# EAGLE design basic-HR20 (EAGLE 6.6.0)
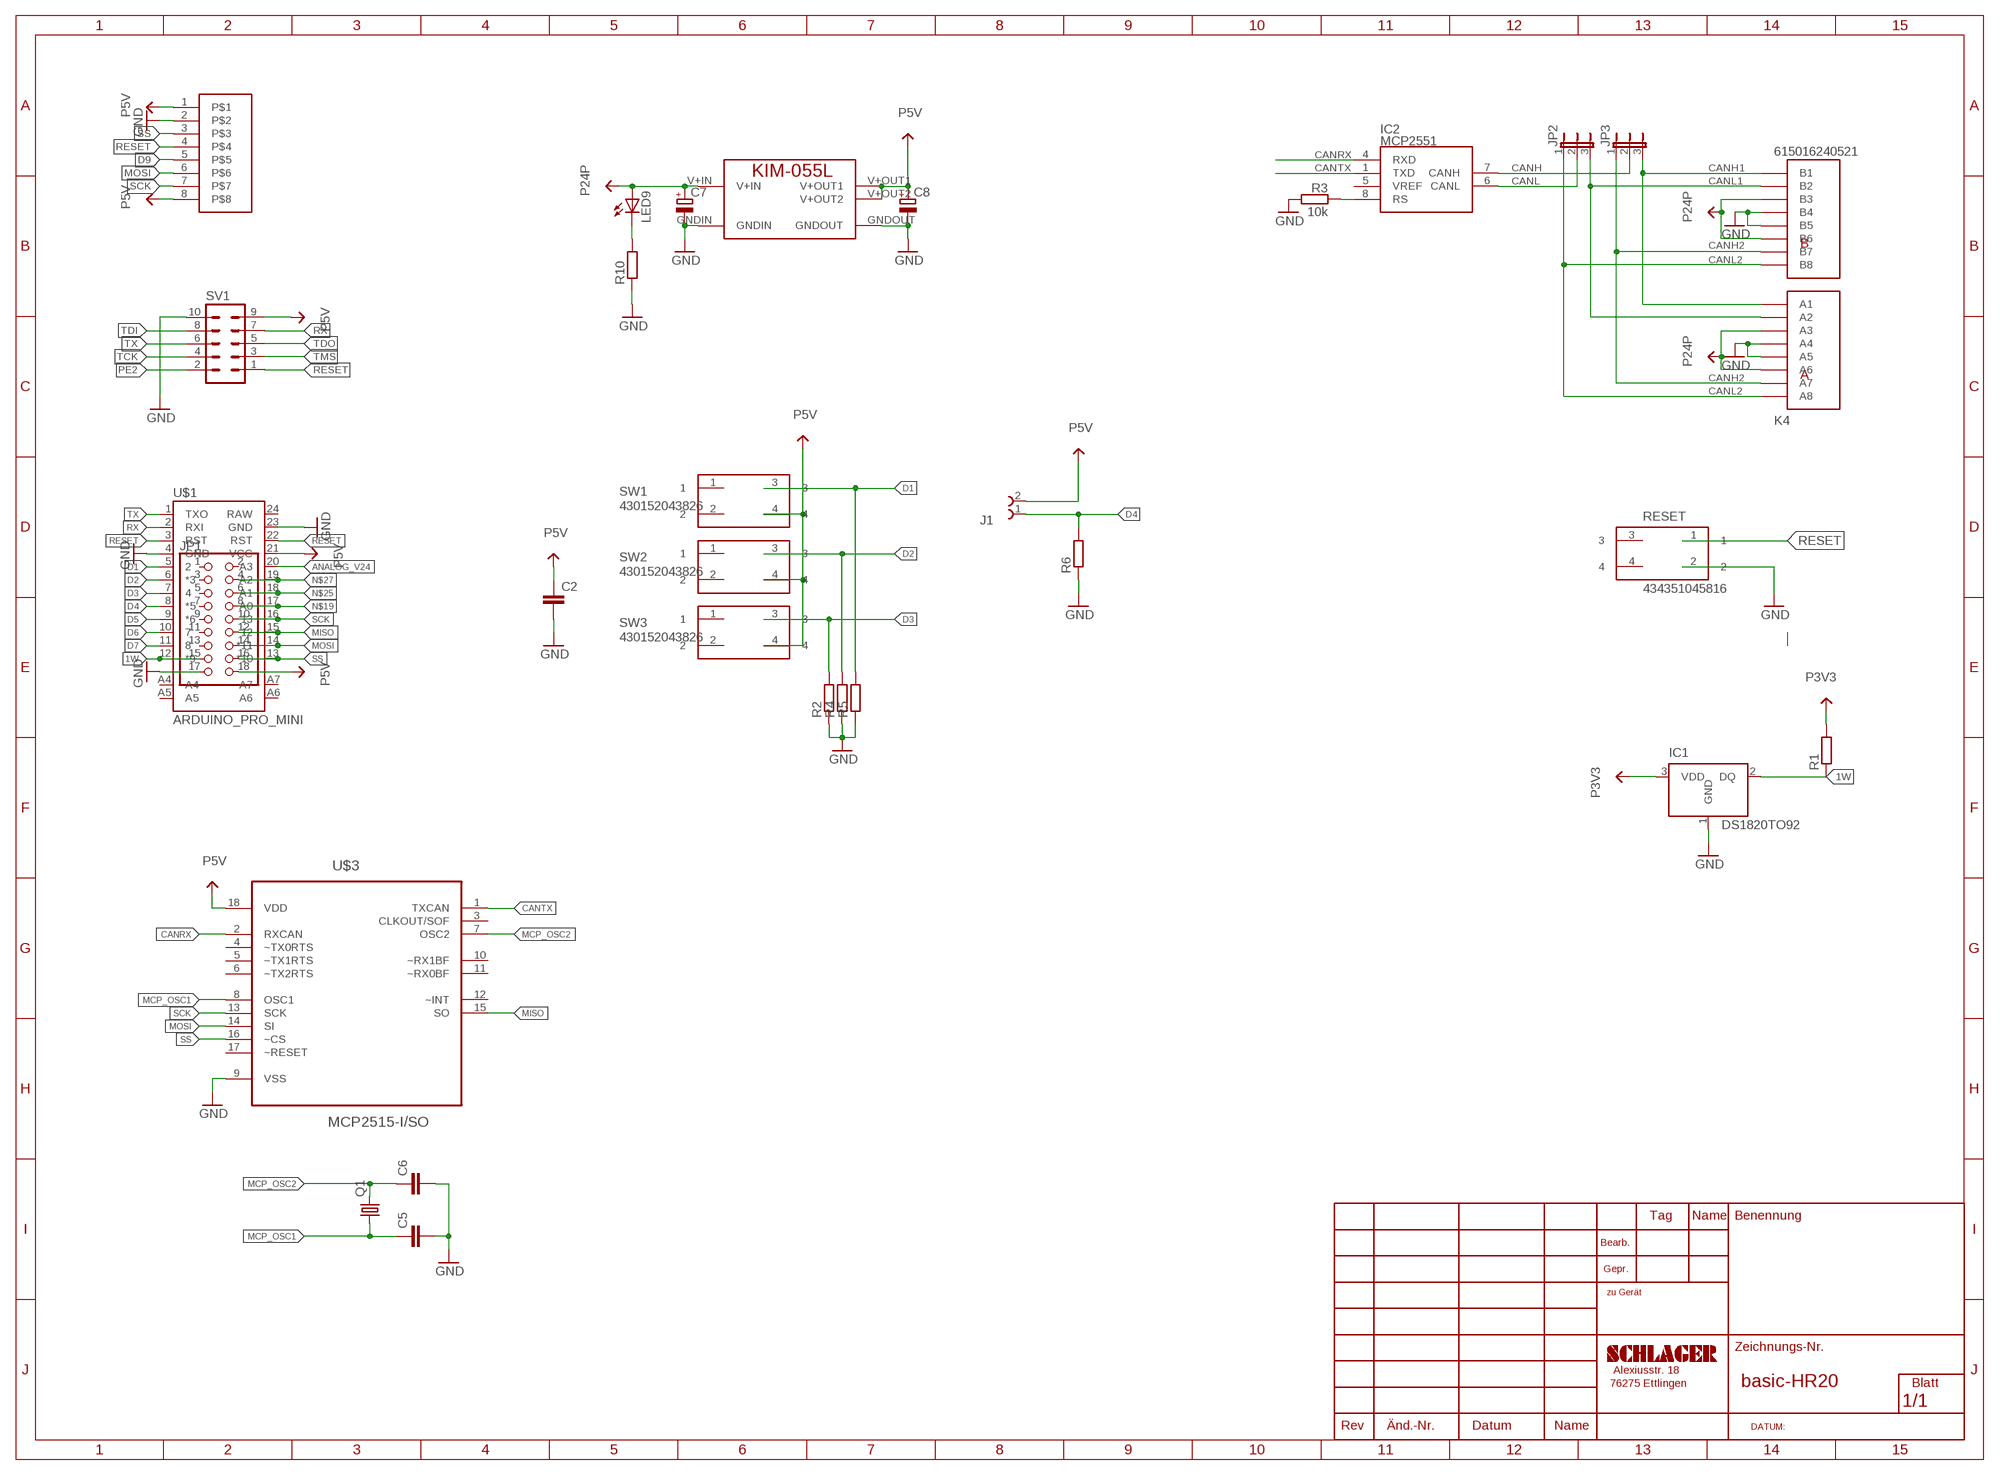
[diagram p0: schematic, sheet 1]

## Parts
C2  C-EUC0805  [C0805]
C5  C-EUC0805  [C0805]
C6  C-EUC0805  [C0805]
C7  CPOL-EUE5-10.5  [E5-10,5]
C8  CPOL-EUE5-10.5  [E5-10,5]
IC1  DS1820TO92  [TO-92]
IC2  MCP2551  [SO-8]
J1  691312510002  [691312510002]
JP1  PINHD-2X9  [2X09]
JP2  JP2E  [JP2]
JP3  JP2E  [JP2]
K4  615016240521  [615016240521]
LED9  LED3MM  [LED3MM]
MOD1  KIM-055L  [KIM-055L]
Q1  CRYSTALHC49S  [HC49/S]
R1  R-EU_M0805  [M0805]
R2  R-EU_R0805  [R0805]
R3  10k  R-EU_R0603  [R0603]
R4  R-EU_R0805  [R0805]
R5  R-EU_R0805  [R0805]
R6  R-EU_R0805  [R0805]
R10  R-EU_R0805  [R0805]
RESET  434351045816  [434351045816]
SV1  ML10  [ML10]
SW1  430152043826  [430152043826]
SW2  430152043826  [430152043826]
SW3  430152043826  [430152043826]
U$1  ARDUINO_PRO_MINI  [ARDUINO_PRO_MINI]
U$2  1.44-128X128  [1.44-128X128]
U$3  MCP2515-I/SO  [SOIC127P1034X264-18N]

## Nets
1W: IC1.2(DQ) JP1.15 R1.1 U$1.12(*9)
ANALOG_V24: U$1.20(A3)
CANH: IC2.7(CANH) JP3.2
CANH1: JP3.3 K4.A1 K4.B1
CANH2: JP3.1 K4.A7 K4.B7
CANL: IC2.6(CANL) JP2.2
CANL1: JP2.3 K4.A2 K4.B2
CANL2: JP2.1 K4.A8 K4.B8
CANRX: IC2.4(RXD) U$3.2(RXCAN)
CANTX: IC2.1(TXD) U$3.1(TXCAN)
D1: R5.2 SW1.3 U$1.5
D2: R4.2 SW2.3 U$1.6(*3)
D3: R2.2 SW3.3 U$1.7
D4: J1.1 R6.2 U$1.8(*5)
D5: U$1.9(*6)
D6: U$1.10
D7: U$1.11
D9: U$2.5
GND: C2.2 C5.2 C6.2 C7.- C8.- IC1.1(GND) JP1.17 K4.A4 K4.A5 K4.B4 K4.B5 MOD1.GNDIN MOD1.GNDOUT R2.1 R3.2 R4.1 R5.1 R6.1 R10.1 RESET.2 SV1.10 U$1.4(GND) U$1.23(GND) U$2.2 U$3.9(VSS)
MCP_OSC1: C5.1 Q1.1 U$3.8(OSC1)
MCP_OSC2: C6.1 Q1.2 U$3.7(OSC2)
MISO: JP1.12 U$1.15 U$3.15(SO)
MOSI: JP1.14 U$1.14(*11) U$2.6 U$3.14(SI)
N$2: IC2.8(RS) R3.1
N$9: LED9.K(C) R10.2
N$19: JP1.8 U$1.17(A0)
N$25: JP1.6 U$1.18(A1)
N$27: JP1.4 U$1.19(A2)
P3V3: IC1.3(VDD) R1.2
P5V: C2.1 C8.+ J1.2 JP1.18 MOD1.V+OUT1 MOD1.V+OUT2 SV1.9 SW1.4 SW2.4 SW3.4 U$1.21(VCC) U$2.1 U$2.8 U$3.18(VDD)
P24P: C7.+ K4.A3 K4.A6 K4.B3 K4.B6 LED9.A MOD1.V+IN
PE2: SV1.2
RESET: RESET.1 SV1.1 U$1.3(RST) U$1.22(RST) U$2.4
RX: SV1.7 U$1.2(RXI)
SCK: JP1.10 U$1.16 U$2.7 U$3.13(SCK)
SS: JP1.16 U$1.13(*10) U$2.3 U$3.16(~CS)
TCK: SV1.4
TDI: SV1.8
TDO: SV1.5
TMS: SV1.3
TX: SV1.6 U$1.1(TXO)
Unconnected: IC2.2(GND) IC2.3(VCC) IC2.5(VREF) JP1.1 JP1.2 JP1.3 JP1.5 JP1.7 JP1.9 JP1.11 JP1.13 RESET.3 RESET.4 SW1.1 SW1.2 SW2.1 SW2.2 SW3.1 SW3.2 U$1.24(RAW) U$1.A4 U$1.A5 U$1.A6 U$1.A7 U$3.3(CLKOUT/SOF) U$3.4(~TX0RTS) U$3.5(~TX1RTS) U$3.6(~TX2RTS) U$3.10(~RX1BF) U$3.11(~RX0BF) U$3.12(~INT) U$3.17(~RESET)

## Library data of the parts
C2 C5 C6 = schlager_passiv:C-EU: CAPACITOR, European symbol
C7 C8 = schlager_passiv:CPOL-EU: POLARIZED CAPACITOR, European symbol
IC1 = schlager_ics:DS1820: DS1820 - 1-Wire Digital Thermometer
IC2 = MYMCHIP:MCP2551: CAN Transceiver
J1 = Eagle_TERMINAL_BLOCKS_rev16a:691312510002: WR-TBL Serie 312 - 5.08 mm Open Horizontal PCB Header , 2 Pins=>Code : Con_TBL_Pluggable_5.08_PCB_THT_Simple_H_691312510002 <http://katalog.we-online.de/media/images/eican/Con_TBL_Pluggable_5.08_PCB_THT_Simple_H_6913125100xx_pf2.jpg> Details see: http://katalog.we-online.de/en/em/691_312_510_0xx Created 2014-06-25, Karrer Zheng 2014 (C) Würth Elektronik
JP1 = pinhead:PINHD-2X9: PIN HEADER
JP2 JP3 = jumper:JP2E: JUMPER
K4 = Wuerth_Elektronik_eiCan_Communication_Connectors:615016240521: WR-MJ Horizontal Shielded Dual Stacked Port with EMI Panel Finger 8P8C Modular Jack Tab Up & Down, 16 Pins
LED9 = led:LED: LED OSRAM: - CHIPLED LG R971, LG N971, LY N971, LG Q971, LY Q971, LO R971, LY R971 LH N974, LH R974 LS Q976, LO Q976, LY Q976 LO Q996 - Hyper CHIPLED LW Q18S LB Q993, LB Q99A, LB R99A - SideLED LS A670, LO A670, LY A670, LG A670, LP A670 LB A673, LV A673, LT A673, LW A673 LH A674 LY A675 LS A676, LA A676, LO A676, LY A676, LW A676 LS A679, LY A679, LG A679 - Hyper Micro SIDELED® LS Y876, LA Y876, LO Y876, LY Y876 LT Y87S - SmartLED LW L88C, LW L88S LB L89C, LB L89S, LG L890 LS L89K, LO L89K, LY L89K LS L896, LA L896, LO L896, LY L896 - TOPLED LS T670, LO T670, LY T670, LG T670, LP T670 LSG T670, LSP T670, LSY T670, LOP T670, LYG T670 LG T671, LOG T671, LSG T671 LB T673, LV T673, LT T673, LW T673 LH T674 LS T676, LA T676, LO T676, LY T676, LB T676, LH T676, LSB T676, LW T676 LB T67C, LV T67C, LT T67C, LS T67K, LO T67K, LY T67K, LW E67C LS E67B, LA E67B, LO E67B, LY E67B, LB E67C, LV E67C, LT E67C LW T67C LS T679, LY T679, LG T679 LS T770, LO T770, LY T770, LG T770, LP T770 LB T773, LV T773, LT T773, LW T773 LH T774 LS E675, LA E675, LY E675, LS T675 LS T776, LA T776, LO T776, LY T776, LB T776 LHGB T686 LT T68C, LB T68C - Hyper Mini TOPLED® LB M676 - Mini TOPLED Santana® LG M470 LS M47K, LO M47K, LY M47K Source: http://www.osram.convergy.de LUXEON: - LUMILED® LXK2-PW12-R00, LXK2-PW12-S00, LXK2-PW14-U00, LXK2-PW14-V00 LXK2-PM12-R00, LXK2-PM12-S00, LXK2-PM14-U00 LXK2-PE12-Q00, LXK2-PE12-R00, LXK2-PE12-S00, LXK2-PE14-T00, LXK2-PE14-U00 LXK2-PB12-K00, LXK2-PB12-L00, LXK2-PB12-M00, LXK2-PB14-N00, LXK2-PB14-P00, LXK2-PB14-Q00 LXK2-PR12-L00, LXK2-PR12-M00, LXK2-PR14-Q00, LXK2-PR14-R00 LXK2-PD12-Q00, LXK2-PD12-R00, LXK2-PD12-S00 LXK2-PH12-R00, LXK2-PH12-S00 LXK2-PL12-P00, LXK2-PL12-Q00, LXK2-PL12-R00 Source: www.luxeon.com KINGBRIGHT: KA-3528ASYC Source: www.kingbright.com
MOD1 = kim055l:KIM-055L: 5V 5amp DC DC module. IMPORANT: Add low ESR input & output capacitors. V+OUT1 & V+OUT2 internally connected.
Q1 = crystal:CRYSTAL: CRYSTAL; OC_FARNELL: 1667008; OC_NEWARK: unknown
R1 R2 R4-R6 R10 = schlager_passiv:R-EU_: RESISTOR, European symbol
R3 = rcl:R-EU_: RESISTOR, European symbol
RESET = Illuminated_Switches:434351045816: WS-TUS-3.5x4.7 mm side push SMD Tact Switch, 4 pins
SV1 = X_Pfostenstecker:ML10: HARTING; OC_FARNELL: unknown; OC_NEWARK: unknown
SW1-SW3 = Wuerth_Elektronik_Switch:430152043826: WS-TSS-6x6 mm SMD Tact Switch,4 pins
U$1 = SparkFun-Boards:ARDUINO_PRO_MINI
U$2 = schlager_modules:1.44-128X128
U$3 = schlager_ics:MCP2515-I/SO: CAN Controller; MPN: MCP2515-I/SO; OC_FARNELL: 1292239; OC_NEWARK: 29H7136; PACKAGE: SOIC-18; SUPPLIER: Microchip

## Net classes
4 USBpair: width 0.254 mm, drill 0.406 mm, clearance 0.508 mm

## Board
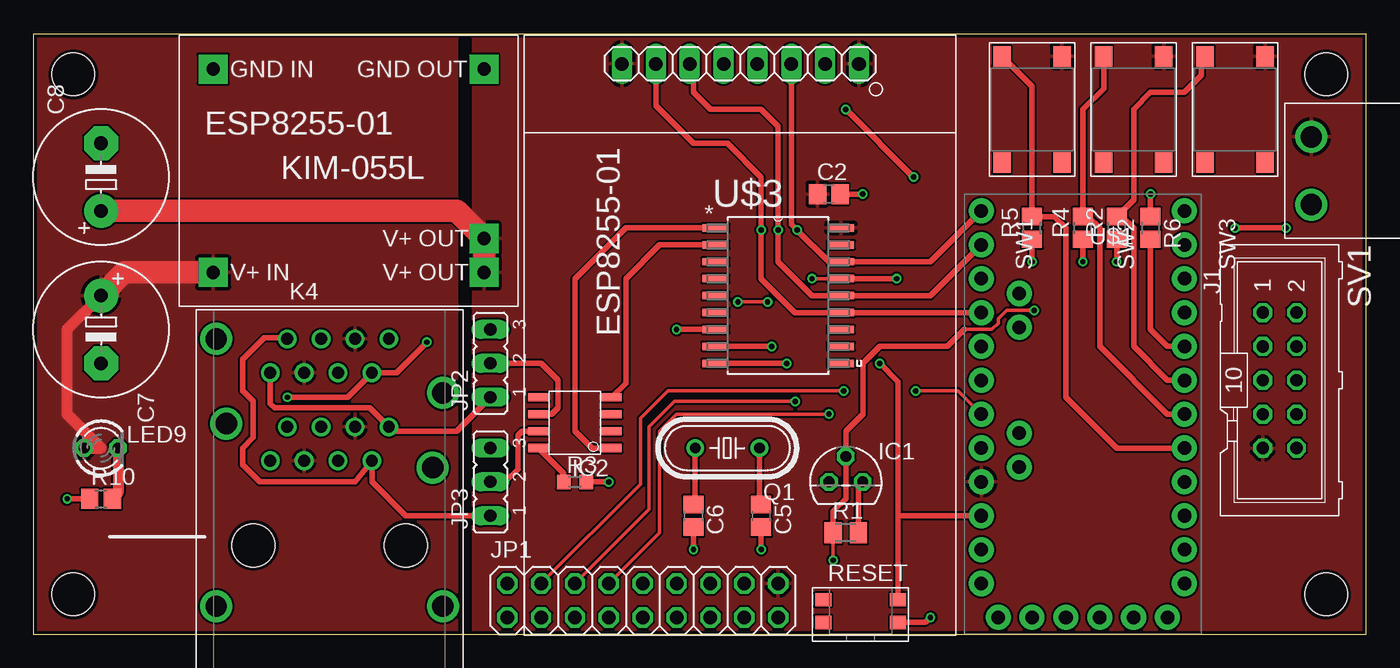
[diagram p1: board, top side]
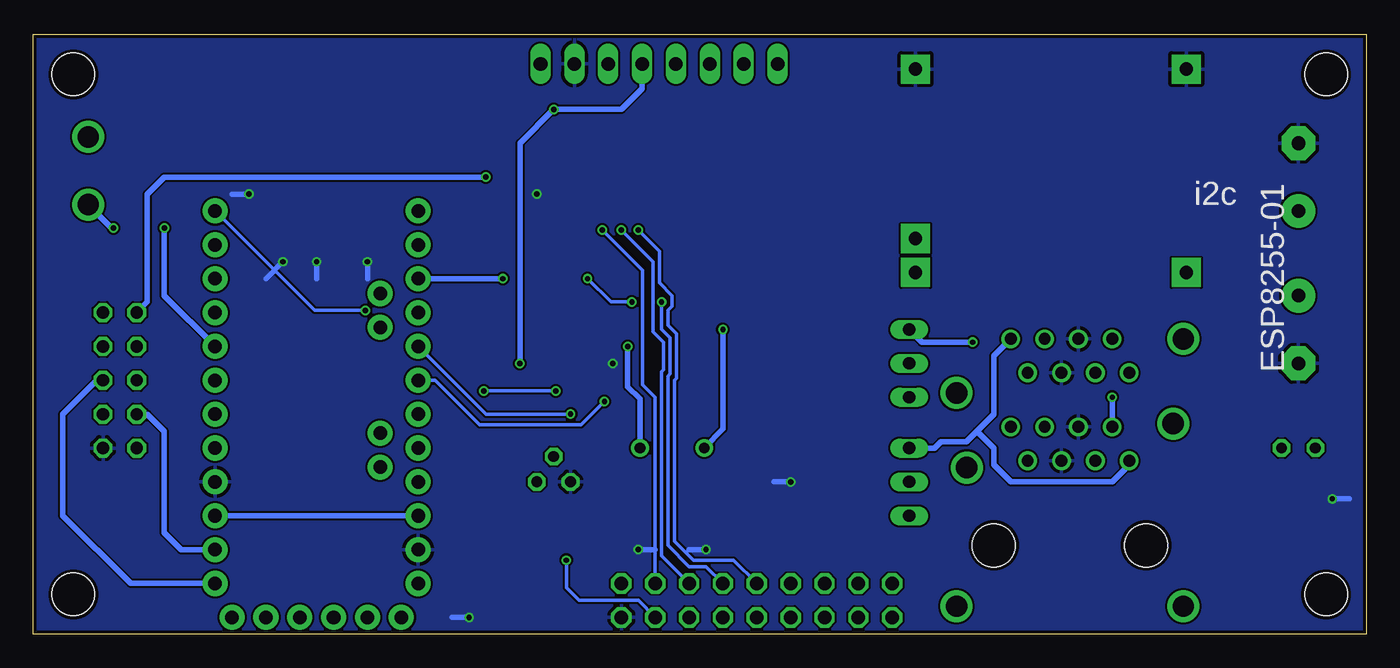
[diagram p2: board, bottom side, seen from below]

Size 100 x 45 mm. Coordinates in mm from the lower left corner, seen from the top.
Outline: 0,0 100,0 100,45 0,45 0,0
Copper layers (1*16): Top 0.035mm / dielectric 1.5mm / Bottom 0.035mm
Design rules "ITEADstudio_DRC": minimum track width 6mil, minimum drill 12mil, track to track 6mil, track to pad 6mil, pad to pad 6mil, via to via 6mil, smd to smd 0mil, copper to edge 10mil, drill to drill 10mil, minimum pad ring 10mil, minimum via ring 6mil, stop-mask expansion 2mil, vias tented up to drill 100mil, thermal gap 10mil
Holes 3.2 mm at 3,3 3,42 97,42 97,3

### Footprints (pad centres in the part's own frame; a part is rotated, then mirrored left to right if it is on the bottom)
C0805 = smd 1.3 x 1.5: 1 -0.85,0; 2 0.85,0
E5-10,5 = drill 1.016 pad 2.54: + -2.54,0 | drill 1.016 pad 2.54 octagon: - 2.54,0
TO-92 = drill 0.813 pad 1.27 octagon: 1 -1.27,0; 2 0,1.905; 3 1.27,0
SO-8 = smd 0.61 x 1.524: 1 0,-0.203; 2 1.27,-0.203; 3 2.54,-0.203; 4 3.81,-0.203; 5 3.81,5.283; 6 2.54,5.283; 7 1.27,5.283; 8 0,5.283
691312510002 = drill 1.6: 1 -5.08,0; 2 0,0
2X09 = drill 1.016 octagon: 1 -10.16,-1.27; 2 -10.16,1.27; 3 -7.62,-1.27; 4 -7.62,1.27; 5 -5.08,-1.27; 6 -5.08,1.27; 7 -2.54,-1.27; 8 -2.54,1.27; 9 0,-1.27; 10 0,1.27; 11 2.54,-1.27; 12 2.54,1.27; 13 5.08,-1.27; 14 5.08,1.27; 15 7.62,-1.27; 16 7.62,1.27; 17 10.16,-1.27; 18 10.16,1.27
JP2 = drill 0.914 long: 1 -2.54,0; 2 0,0; 3 2.54,0
615016240521 = drill 0.89: A1 -4.445,-1.27; A2 -3.175,1.27; A3 -1.905,-1.27; A4 -0.635,1.27; A5 0.635,-1.27; A6 1.905,1.27; A7 3.175,-1.27; A8 4.445,1.27; B1 4.445,7.87; B2 3.175,5.33; B3 1.905,7.87; B4 0.635,5.33; B5 -0.635,7.87; B6 -1.905,5.33; B7 -3.175,7.87; B8 -4.445,5.33 | drill 1.6: Z1 -8.505,-12.19; Z2 8.505,-12.19; Z3 7.745,-1.78; Z4 -7.745,1.52; Z5 8.505,3.81; Z6 -8.505,7.87 | hole 3.25: -5.715,-7.62; 5.715,-7.62
LED3MM = drill 0.813 octagon: A -1.27,0; K 1.27,0
KIM-055L = drill 1 pad 2.184 square: GNDIN -10.16,7.62; GNDOUT 10.16,7.62; V+IN -10.16,-7.62; V+OUT1 10.16,-5.08; V+OUT2 10.16,-7.62
HC49/S = drill 0.813: 1 -2.413,0; 2 2.413,0
M0805 = smd 1.3 x 1.6: 1 -0.95,0; 2 0.95,0
R0805 = smd 1.3 x 1.5: 1 -0.85,0; 2 0.85,0
R0603 = smd 1 x 1.1: 1 -0.85,0; 2 0.85,0
434351045816 = smd 1.2 x 1: 1 2.8,0.85; 2 2.8,-0.85; 3 -2.8,0.85; 4 -2.8,-0.85
ML10 = drill 0.914 octagon: 1 -5.08,-1.27; 2 -5.08,1.27; 3 -2.54,-1.27; 4 -2.54,1.27; 5 0,-1.27; 6 0,1.27; 7 2.54,-1.27; 8 2.54,1.27; 9 5.08,-1.27; 10 5.08,1.27
430152043826 = smd 1.55 x 1.3: 1 -3.975,2.25; 2 -3.975,-2.25; 3 3.975,2.25; 4 3.975,-2.25
ARDUINO_PRO_MINI = drill 1.016 pad 1.88: 1 -7.62,12.7; 2 -7.62,10.16; 3 -7.62,7.62; 4 -7.62,5.08; 5 -7.62,2.54; 6 -7.62,0; 7 -7.62,-2.54; 8 -7.62,-5.08; 9 -7.62,-7.62; 10 -7.62,-10.16; 11 -7.62,-12.7; 12 -7.62,-15.24; 13 7.62,-15.24; 14 7.62,-12.7; 15 7.62,-10.16; 16 7.62,-7.62; 17 7.62,-5.08; 18 7.62,-2.54; 19 7.62,0; 20 7.62,2.54; 21 7.62,5.08; 22 7.62,7.62; 23 7.62,10.16; 24 7.62,12.7; A4 4.763,1.429; A5 4.763,3.969; A6 4.763,-9.049; A7 4.763,-6.509; BLK -6.35,15.24; GND -3.81,15.24; GRN 6.35,15.24; RXI 1.27,15.24; TXO 3.81,15.24; VCC -1.27,15.24
1.44-128X128 = drill 1.016 long: 1 7.27,2.14; 2 9.81,2.14; 3 12.35,2.14; 4 14.89,2.14; 5 17.43,2.14; 6 19.97,2.14; 7 22.51,2.14; 8 25.05,2.14
SOIC127P1034X264-18N = smd 1.981 x 0.559: 1 -4.699,5.08; 2 -4.699,3.81; 3 -4.699,2.54; 4 -4.699,1.27; 5 -4.699,0; 6 -4.699,-1.27; 7 -4.699,-2.54; 8 -4.699,-3.81; 9 -4.699,-5.08; 10 4.699,-5.08; 11 4.699,-3.81; 12 4.699,-2.54; 13 4.699,-1.27; 14 4.699,0; 15 4.699,1.27; 16 4.699,2.54; 17 4.699,3.81; 18 4.699,5.08

### Placement (x,y rotation side)
C2  59.69,33.02 0 top
C5  54.61,8.89 270 top
C6  49.53,8.89 270 top
C7  5.08,22.86 270 top
C8  5.08,34.29 90 top
IC1  60.96,11.43 0 top
IC2  43.18,13.97 90 top
J1  95.89,37.31 90 top
JP1  45.72,2.54 0 top
JP2  34.29,20.32 90 top
JP3  34.29,11.43 90 top
K4  22.23,14.29 0 top
LED9  5.08,13.97 0 top
MOD1  23.65,34.77 0 top
Q1  52.07,13.97 180 top
R1  60.96,7.62 0 top
R2  81.28,30.48 90 top
R3  40.64,11.43 0 top
R4  78.74,30.48 90 top
R5  74.93,30.48 90 top
R6  83.82,30.48 270 top
R10  5.08,10.16 0 top
RESET  62.07,1.75 0 top
SV1  93.5,19.05 270 top
SW1  74.93,39.37 90 top
SW2  82.55,39.37 90 top
SW3  90.17,39.37 90 top
U$1  78.74,16.51 180 top
U$2  69.22,44.93 180 top
U$3  55.88,25.4 0 top

### Tracks (layer width: path | path; a pad name or v marks a point on that pad's centre or on a via)
1W  (via drill 0.4)
  Top 0.254: 69.85,22.86 71.91,22.86 72.39,23.34 72.39,23.65 73.03,24.29 v75.09,24.29 | v60.01,5.56 R1.1
  Top 0.406: R1.1 60.01,9.21 60.96,10.16 IC1.2 60.96,15.24 62.23,16.51 62.23,20.32 63.5,21.59 68.58,21.59 69.85,22.86
  Bottom 0.254: v75.09,24.29 78.9,24.29 U$1.12 | JP1.15 54.61,2.54 59.05,2.54 60.01,3.49 v60.01,5.56
CANH
  Top 0.406: IC2.7 36.67,15.24 36.35,14.92 36.35,12.38 35.4,11.43 JP3.2
CANH1
  Bottom 0.406: JP3.3 32.38,13.97 31.91,14.45 30,14.45 29.21,15.24 | 29.21,15.24 27.94,16.51 27.94,20.89 K4.B1 | K4.A1 17.78,12.7 19.05,11.43 26.67,11.43 27.94,12.7 27.94,13.97 29.21,15.24
CANH2
  Top 0.406: JP3.1 27.94,8.89 25.4,11.43 K4.A7 24.13,11.43 16.99,11.43 15.72,12.7 15.72,13.97 16.51,14.76 16.51,17.46 15.72,18.26 15.72,20.64 17.3,22.23 18.98,22.23 K4.B7
CANL
  Top 0.406: JP2.2 38.1,20.32 39.37,19.05 39.37,16.99 38.89,16.51 IC2.6
CANL1  (via drill 0.4)
  Top 0.406: v19.05,17.78 23.56,17.78 K4.B2 27.24,19.62 v29.53,21.91
  Bottom 0.406: K4.A2 v19.05,17.78 | v29.53,21.91 33.34,21.91 JP2.3
CANL2
  Top 0.406: JP2.1 31.75,15.24 26.99,15.24 K4.A8 25.24,16.99 18.1,16.99 17.78,17.3 K4.B8
CANRX
  Top 0.406: U$3.2 46.99,29.21 44.45,26.67 44.45,18.85 IC2.4
CANTX
  Top 0.406: U$3.1 44.45,30.48 40.64,26.67 40.64,15.24 41.91,13.97 IC2.1
D1
  Top 0.406: SW1.3 74.93,41.09 R5.2 76.62,31.33 77.47,30.48 77.47,17.78 81.28,13.97 U$1.5
D2
  Top 0.406: SW2.3 80.3,40.93 78.74,39.37 R4.2 79.16,31.33 80.01,30.48 80.01,21.59 85.09,16.51 U$1.6
D3
  Top 0.406: SW3.3 87.63,43.05 87.63,41.91 86.36,40.64 83.82,40.64 82.55,39.37 82.55,32.6 R2.2 81.7,31.33 82.55,30.48 82.55,21.59 85.09,19.05 U$1.7
D4  (via drill 0.4)
  Top 0.406: U$1.8 85.09,21.59 83.82,22.86 R6.2 | v93.98,30.48 v90.17,30.48
  Bottom 0.406: v90.17,30.48 90.17,25.4 U$1.8 | v93.98,30.48 94.14,30.48 J1.1
GND  (via drill 0.4)
  Top 0.406: U$3.9 v56.52,20.32 | C6.2 v49.53,6.35 | C5.2 v54.61,6.35 | R3.2 v43.18,11.43 | R10.1 v2.54,10.16 | C2.2 v62.23,33.02 62.39,33.02 | RESET.2 66.94,0.9 v67.31,1.27 | R5.1 v74.93,27.94 | R4.1 v78.74,27.94 | R2.1 v81.28,27.94 | R6.1 v83.82,33.02
  Bottom 0.406: v49.53,6.35 50.8,6.35 | v54.61,6.35 53.34,6.35 | v43.18,11.43 44.45,11.43 | v2.54,10.16 1.27,10.16 | v67.31,1.27 68.58,1.27 | v74.93,27.94 74.93,26.67 | v78.74,27.94 78.74,26.67 | v81.28,27.94 82.55,26.67 | v83.82,33.02 85.09,33.02
  pour Bottom: -8.89,72.39 120.65,72.39 120.65,-13.97 -8.89,-13.97
MCP_OSC1  (via drill 0.4)
  Top 0.406: v55.4,21.59 U$3.8 | Q1.1 54.48,9.87 C5.1
  Bottom 0.406: Q1.1 54.48,17.65 55.4,18.57 v55.4,21.59
MCP_OSC2  (via drill 0.4)
  Top 0.406: Q1.2 49.66,9.87 C6.1 | v48.26,22.86 U$3.7
  Bottom 0.406: Q1.2 49.66,14 48.26,15.4 v48.26,22.86
MISO  (via drill 0.4)
  Top 0.254: v52.86,24.92 v55.09,24.92 | v58.42,26.67 U$3.15
  Top 0.406: U$3.15 v64.77,26.67
  Bottom 0.254: JP1.12 49.53,5.08 50.8,5.08 52.39,6.67 52.39,19.37 52.23,19.53 52.23,22.23 52.86,22.86 v52.86,24.92 | v55.09,24.92 56.67,24.92 v58.42,26.67
  Bottom 0.406: v64.77,26.67 U$1.15
MOSI  (via drill 0.4)
  Top 0.406: U$1.14 67.31,25.4 U$3.14 58.42,25.4 55.88,27.94 55.88,29.21 v55.88,30.32 55.88,38.1 54.61,39.37 50.8,39.37 49.53,40.64 49.53,42.5 U$2.6
  Bottom 0.254: JP1.14 52.86,5.87 52.86,19.68 52.7,19.84 52.7,21.91 53.5,22.7 53.5,27.94 v55.88,30.32
N$2
  Top 0.406: R3.1 39.79,12.08 IC2.8
N$9
  Top 0.813: LED9.K 6.35,10.58 R10.2
N$19  (via drill 0.4)
  Top 0.254: JP1.8 46.99,7.62 46.99,15.24 48.26,16.51 v59.69,16.51
  Bottom 0.254: v59.69,16.51 66.04,16.51 U$1.17
N$25  (via drill 0.4)
  Top 0.254: v57.15,17.46 48.1,17.46 46.2,15.56 46.2,9.37 JP1.6
  Bottom 0.254: U$1.18 69.85,19.05 66.52,15.72 58.9,15.72 v57.15,17.46
N$27  (via drill 0.4)
  Top 0.254: JP1.4 45.56,11.27 45.56,16.19 47.62,18.26 v60.8,18.26 | v66.2,18.26 69.37,18.26 U$1.19
  Bottom 0.254: v60.8,18.26 v66.2,18.26
P3V3
  Top 0.406: R1.2 61.91,11.11 IC1.3
P5V
  Top 1.676: C8.+ 31.75,31.75 MOD1.V+OUT1 MOD1.V+OUT2
  pour Top: 33.02,68.58 109.22,68.58 109.22,-13.97 33.02,-13.97
P24P
  Top 0.813: LED9.A 5.08,13.97 2.54,16.51 2.54,22.86 C7.+
  Top 1.676: MOD1.V+IN 6.83,27.15 C7.+
  pour Top: -16.51,68.58 31.75,68.58 31.75,-15.24 -16.51,-15.24
RESET  (via drill 0.4)
  Top 0.406: v60.96,39.37 v66.04,34.29 | RESET.1 64.87,8.89 | 64.87,8.89 64.87,18.95 v63.5,20.32 | U$1.22 64.87,8.89
  Bottom 0.406: U$2.4 54.33,40.92 55.88,39.37 v60.96,39.37 63.5,36.83 v63.5,20.32 | v66.04,34.29 90.17,34.29 91.44,33.02 91.44,24.92 SV1.1 | U$1.22 U$1.3
RX
  Bottom 0.406: SV1.7 91.44,16.51 90.17,15.24 90.17,7.62 88.9,6.35 U$1.2
SCK  (via drill 0.4)
  Top 0.406: U$1.16 U$3.13 57.15,24.13 54.61,26.67 54.61,29.37 v54.61,30.32 54.61,34.29 52.07,36.83 49.53,36.83 46.7,39.66 U$2.7
  Bottom 0.254: JP1.10 47.47,5.56 50.48,5.56 51.91,6.99 51.91,19.05 51.75,19.21 51.75,22.54 52.39,23.18 52.39,24.29 52.07,24.61 52.07,25.4 53.02,26.35 53.02,28.73 v54.61,30.32
SS  (via drill 0.4)
  Top 0.406: U$1.13 67.31,27.94 U$3.16 59.69,27.94 v57.31,30.32 56.87,30.77 U$2.3
  Bottom 0.254: JP1.16 53.34,17.78 54.29,18.73 54.29,27.3 v57.31,30.32
TX
  Bottom 0.406: SV1.6 95.25,19.05 97.79,16.51 97.79,8.89 92.71,3.81 U$1.1

### Text on the board
tNames: ESP8255-01 | ESP8255-01
bNames: ESP8255-01 | i2c